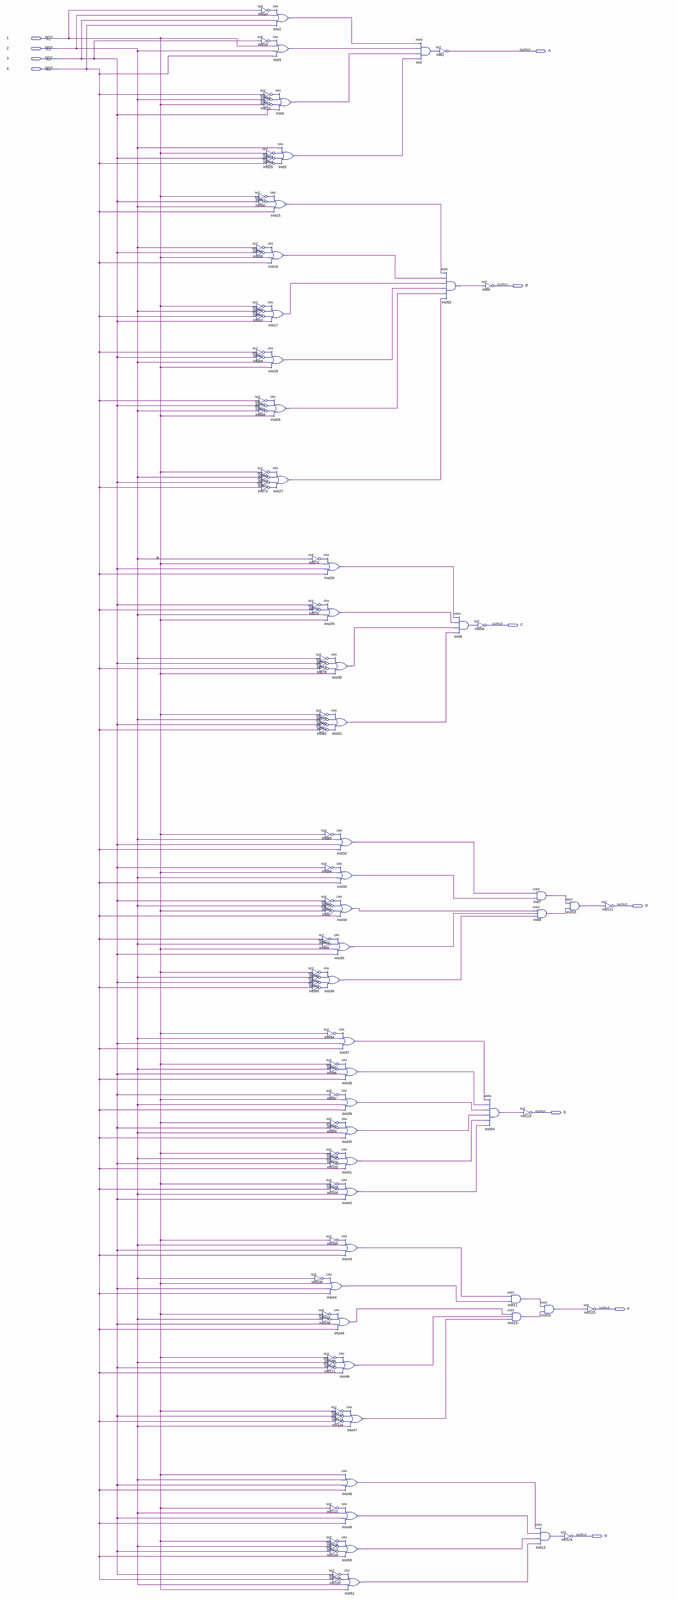
[diagram p0: schematic sheet, whole]
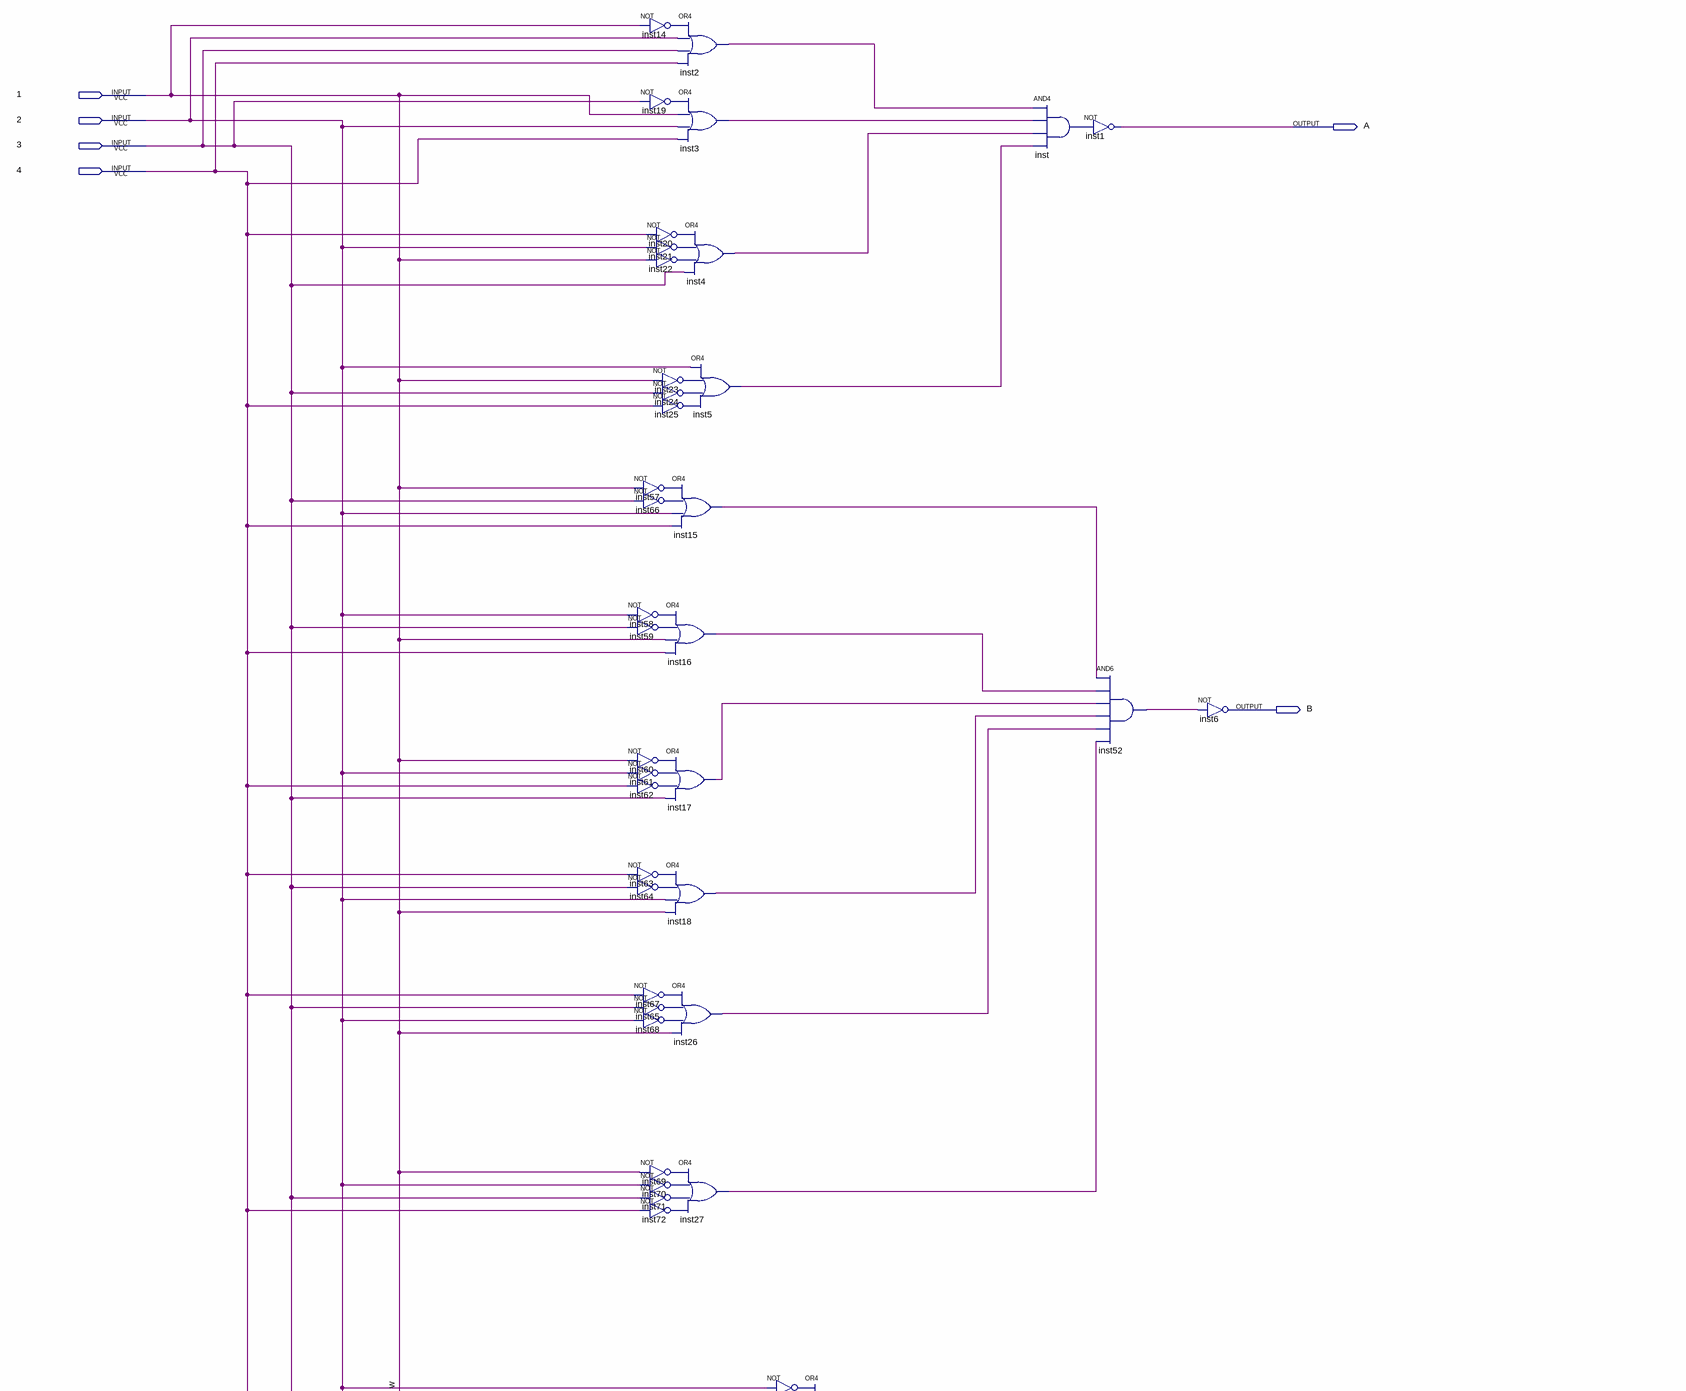
[diagram p1: schematic sheet, upper part]
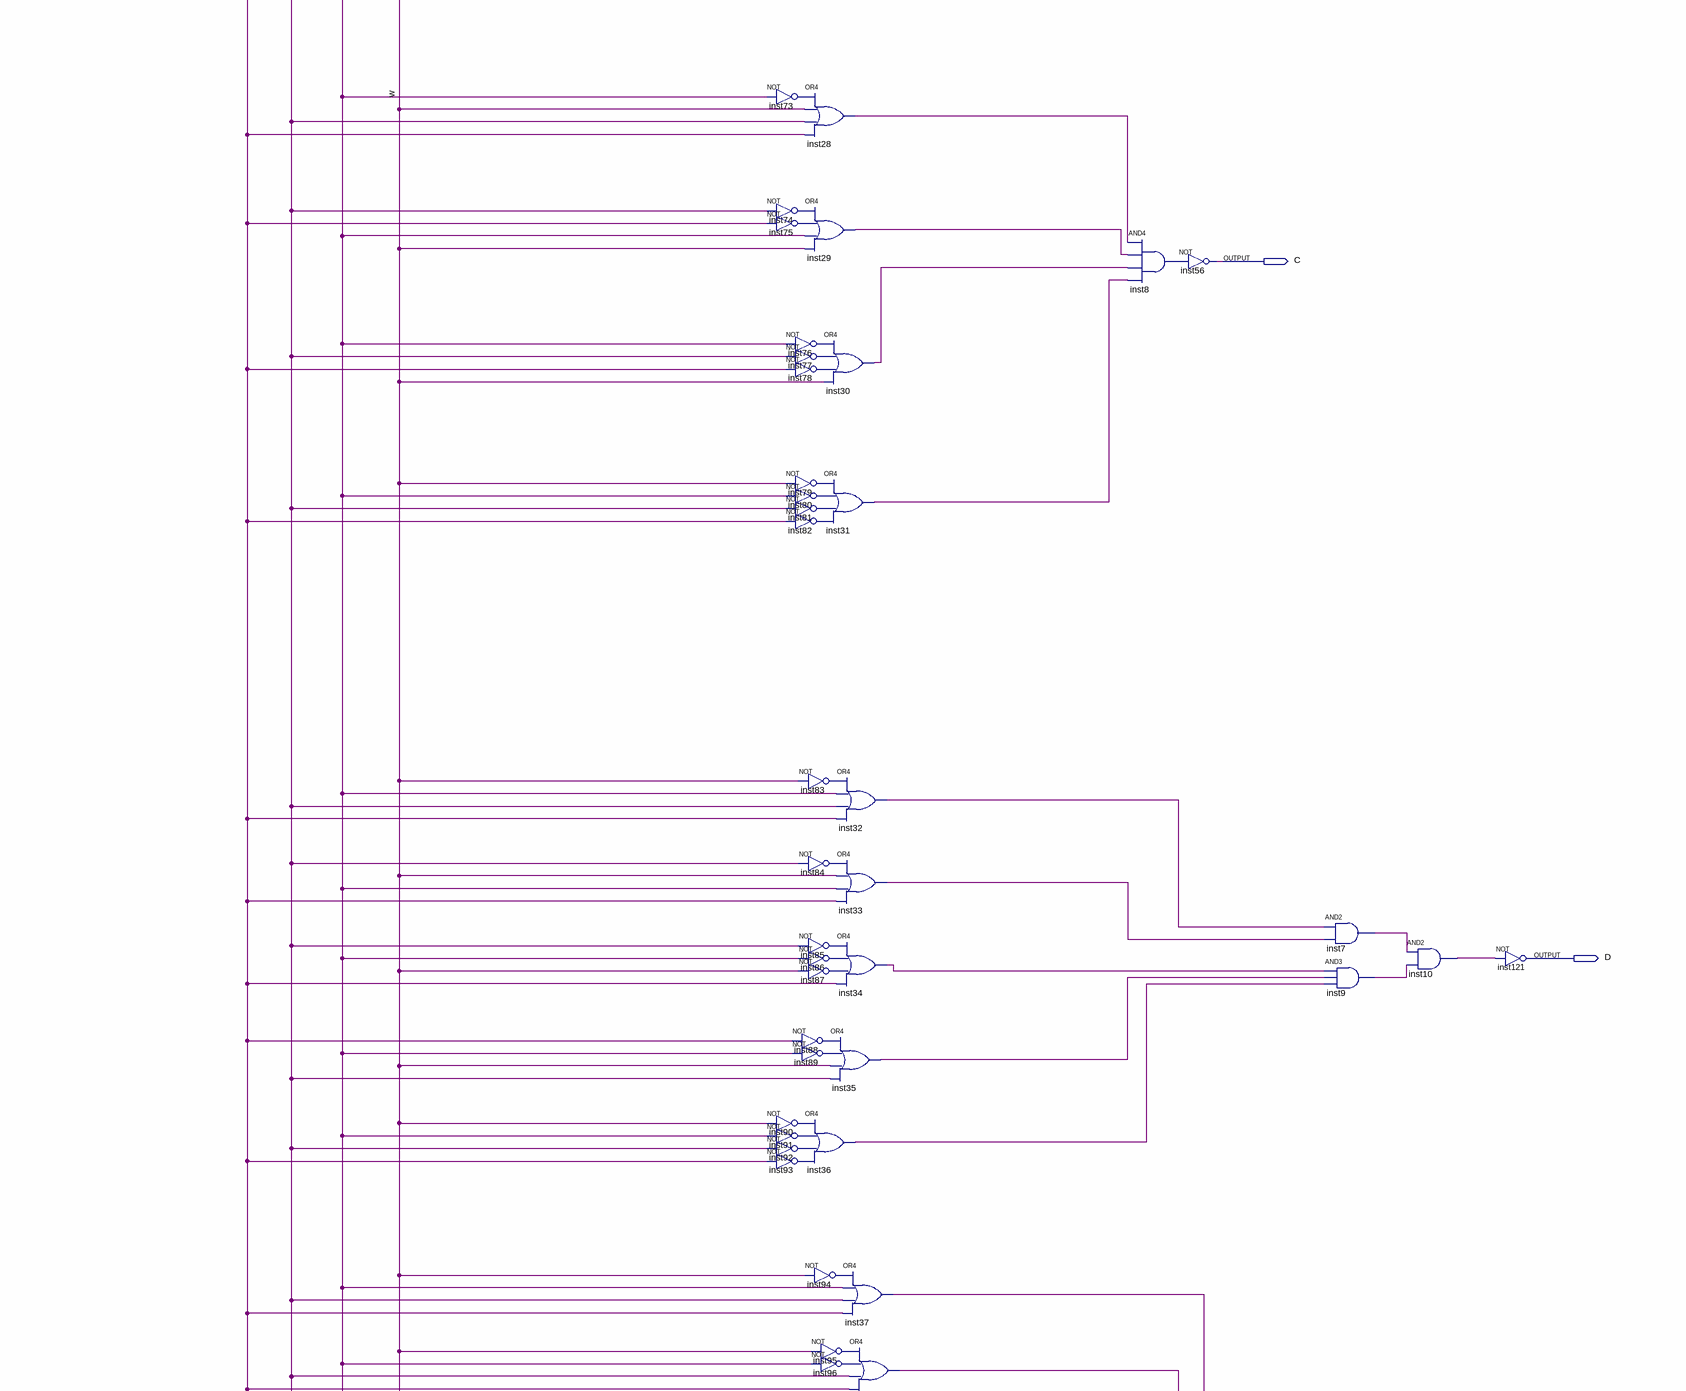
[diagram p2: schematic sheet, middle part]
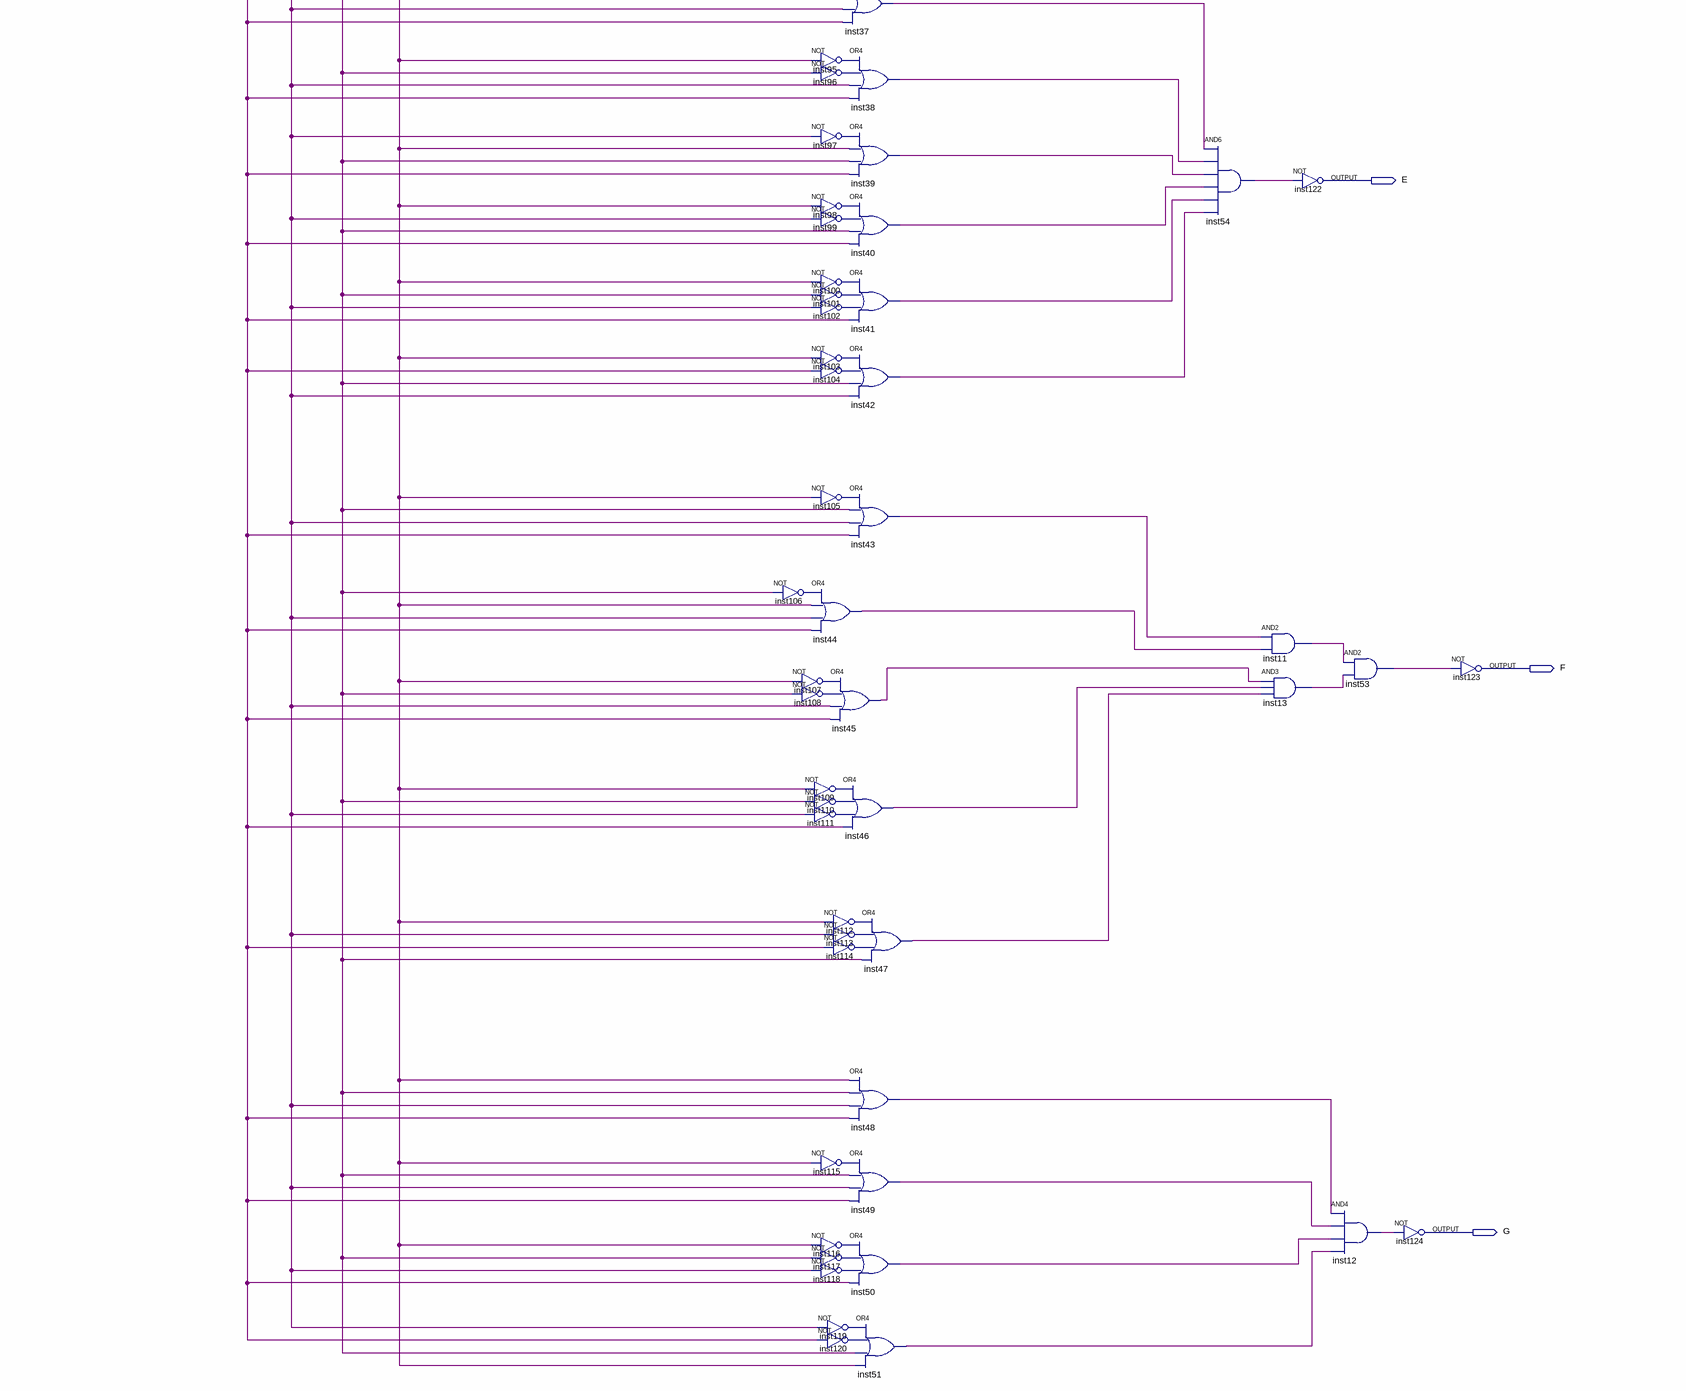
[diagram p3: schematic sheet, lower part]
// Quartus schematic Display.bdf as structural Verilog: 124 symbols, 11 pins
module Display (
  input  \1 ,
  input  \2 ,
  input  \3 ,
  input  \4 ,
  output A,
  output B,
  output C,
  output D,
  output E,
  output F,
  output G
);

  wire inst2_out, inst3_out, inst4_out, inst5_out, inst7_out, inst8_out, inst9_out, inst10_out, inst11_out,
       inst12_out, inst13_out, inst14_out, inst15_out, inst16_out, inst17_out, inst18_out, inst19_out,
       inst20_out, inst21_out, inst22_out, inst23_out, inst24_out, inst25_out, inst26_out, inst27_out,
       inst28_out, inst29_out, inst30_out, inst31_out, inst32_out, inst33_out, inst34_out, inst35_out,
       inst36_out, inst37_out, inst38_out, inst39_out, inst40_out, inst41_out, inst42_out, inst43_out,
       inst44_out, inst45_out, inst46_out, inst47_out, inst48_out, inst49_out, inst50_out, inst51_out,
       inst52_out, inst53_out, inst54_out, inst57_out, inst58_out, inst59_out, inst60_out, inst61_out,
       inst62_out, inst63_out, inst64_out, inst65_out, inst66_out, inst67_out, inst68_out, inst69_out,
       inst70_out, inst71_out, inst72_out, inst73_out, inst74_out, inst75_out, inst76_out, inst77_out,
       inst78_out, inst79_out, inst80_out, inst81_out, inst82_out, inst83_out, inst84_out, inst85_out,
       inst86_out, inst87_out, inst88_out, inst89_out, inst90_out, inst91_out, inst92_out, inst93_out,
       inst94_out, inst95_out, inst96_out, inst97_out, inst98_out, inst99_out, inst100_out, inst101_out,
       inst102_out, inst103_out, inst104_out, inst105_out, inst106_out, inst107_out, inst108_out,
       inst109_out, inst110_out, inst111_out, inst112_out, inst113_out, inst114_out, inst115_out,
       inst116_out, inst117_out, inst118_out, inst119_out, inst120_out, inst_out;

  not inst14 (inst14_out, \1 );
  not inst19 (inst19_out, \3 );
  not inst20 (inst20_out, \4 );
  not inst21 (inst21_out, \2 );
  not inst22 (inst22_out, \1 );
  not inst57 (inst57_out, \1 );
  not inst66 (inst66_out, \3 );
  not inst58 (inst58_out, \2 );
  not inst59 (inst59_out, \3 );
  not inst60 (inst60_out, \1 );
  not inst61 (inst61_out, \2 );
  not inst62 (inst62_out, \4 );
  not inst63 (inst63_out, \4 );
  not inst64 (inst64_out, \3 );
  not inst67 (inst67_out, \4 );
  not inst65 (inst65_out, \3 );
  not inst68 (inst68_out, \2 );
  not inst69 (inst69_out, \1 );
  not inst70 (inst70_out, \2 );
  not inst71 (inst71_out, \3 );
  not inst72 (inst72_out, \4 );
  or inst2 (inst2_out, inst14_out, \2 , \3 , \4 );
  or inst3 (inst3_out, inst19_out, \1 , \2 , \4 );
  or inst4 (inst4_out, inst20_out, inst21_out, inst22_out, \3 );
  or inst5 (inst5_out, \2 , inst23_out, inst24_out, inst25_out);
  not inst23 (inst23_out, \1 );
  not inst24 (inst24_out, \3 );
  not inst25 (inst25_out, \4 );
  or inst15 (inst15_out, inst57_out, inst66_out, \2 , \4 );
  or inst16 (inst16_out, inst58_out, inst59_out, \1 , \4 );
  or inst17 (inst17_out, inst60_out, inst61_out, inst62_out, \3 );
  or inst18 (inst18_out, inst63_out, inst64_out, \2 , \1 );
  or inst26 (inst26_out, inst67_out, inst65_out, inst68_out, \1 );
  or inst27 (inst27_out, inst69_out, inst70_out, inst71_out, inst72_out);
  not inst73 (inst73_out, \2 );
  not inst74 (inst74_out, \3 );
  not inst75 (inst75_out, \4 );
  not inst76 (inst76_out, \2 );
  not inst77 (inst77_out, \3 );
  not inst78 (inst78_out, \4 );
  not inst79 (inst79_out, \1 );
  not inst80 (inst80_out, \2 );
  not inst81 (inst81_out, \3 );
  not inst82 (inst82_out, \4 );
  not inst83 (inst83_out, \1 );
  not inst84 (inst84_out, \3 );
  not inst85 (inst85_out, \3 );
  not inst86 (inst86_out, \2 );
  not inst87 (inst87_out, \1 );
  not inst88 (inst88_out, \4 );
  not inst89 (inst89_out, \2 );
  not inst90 (inst90_out, \1 );
  not inst91 (inst91_out, \2 );
  not inst92 (inst92_out, \3 );
  not inst93 (inst93_out, \4 );
  not inst106 (inst106_out, \2 );
  not inst107 (inst107_out, \1 );
  not inst108 (inst108_out, \2 );
  or inst28 (inst28_out, inst73_out, \1 , \3 , \4 );
  or inst29 (inst29_out, inst74_out, inst75_out, \2 , \1 );
  or inst30 (inst30_out, inst76_out, inst77_out, inst78_out, \1 );
  or inst31 (inst31_out, inst79_out, inst80_out, inst81_out, inst82_out);
  or inst32 (inst32_out, inst83_out, \2 , \3 , \4 );
  or inst33 (inst33_out, inst84_out, \1 , \2 , \4 );
  or inst34 (inst34_out, inst85_out, inst86_out, inst87_out, \4 );
  or inst35 (inst35_out, inst88_out, inst89_out, \1 , \3 );
  or inst36 (inst36_out, inst90_out, inst91_out, inst92_out, inst93_out);
  or inst37 (inst37_out, inst94_out, \2 , \3 , \4 );
  not inst94 (inst94_out, \1 );
  or inst38 (inst38_out, inst95_out, inst96_out, \3 , \4 );
  not inst95 (inst95_out, \1 );
  not inst96 (inst96_out, \2 );
  or inst39 (inst39_out, inst97_out, \1 , \2 , \4 );
  not inst97 (inst97_out, \3 );
  or inst40 (inst40_out, inst98_out, inst99_out, \2 , \4 );
  not inst98 (inst98_out, \1 );
  not inst99 (inst99_out, \3 );
  or inst41 (inst41_out, inst100_out, inst101_out, inst102_out, \4 );
  not inst100 (inst100_out, \1 );
  not inst101 (inst101_out, \2 );
  not inst102 (inst102_out, \3 );
  or inst42 (inst42_out, inst103_out, inst104_out, \2 , \3 );
  not inst103 (inst103_out, \1 );
  not inst104 (inst104_out, \4 );
  or inst43 (inst43_out, inst105_out, \2 , \3 , \4 );
  not inst105 (inst105_out, \1 );
  or inst44 (inst44_out, inst106_out, \1 , \3 , \4 );
  or inst45 (inst45_out, inst107_out, inst108_out, \3 , \4 );
  or inst46 (inst46_out, inst109_out, inst110_out, inst111_out, \4 );
  not inst109 (inst109_out, \1 );
  not inst110 (inst110_out, \2 );
  not inst111 (inst111_out, \3 );
  not inst112 (inst112_out, \1 );
  not inst113 (inst113_out, \3 );
  not inst114 (inst114_out, \4 );
  or inst48 (inst48_out, \1 , \2 , \3 , \4 );
  or inst49 (inst49_out, inst115_out, \2 , \3 , \4 );
  not inst115 (inst115_out, \1 );
  or inst50 (inst50_out, inst116_out, inst117_out, inst118_out, \4 );
  not inst116 (inst116_out, \1 );
  not inst117 (inst117_out, \2 );
  not inst118 (inst118_out, \3 );
  not inst119 (inst119_out, \3 );
  not inst120 (inst120_out, \4 );
  or inst47 (inst47_out, inst112_out, inst113_out, inst114_out, \2 );
  or inst51 (inst51_out, inst119_out, inst120_out, \2 , \1 );
  and inst (inst_out, inst2_out, inst3_out, inst4_out, inst5_out);
  not inst1 (A, inst_out);
  and inst52 (inst52_out, inst15_out, inst16_out, inst17_out, inst18_out, inst26_out, inst27_out);
  and inst8 (inst8_out, inst28_out, inst29_out, inst30_out, inst31_out);
  not inst6 (B, inst52_out);
  not inst56 (C, inst8_out);
  and inst54 (inst54_out, inst37_out, inst38_out, inst39_out, inst40_out, inst41_out, inst42_out);
  not inst122 (E, inst54_out);
  and inst11 (inst11_out, inst43_out, inst44_out);
  and inst13 (inst13_out, inst45_out, inst46_out, inst47_out);
  and inst7 (inst7_out, inst32_out, inst33_out);
  and inst9 (inst9_out, inst34_out, inst35_out, inst36_out);
  and inst53 (inst53_out, inst11_out, inst13_out);
  and inst12 (inst12_out, inst48_out, inst49_out, inst50_out, inst51_out);
  and inst10 (inst10_out, inst7_out, inst9_out);
  not inst124 (G, inst12_out);
  not inst123 (F, inst53_out);
  not inst121 (D, inst10_out);

  // Other names for the same wires on the sheet: w = \1 
endmodule
